# Altium schematic sheet ife19_TS_TSAL-Discharge-TSMP.SchDoc
size A
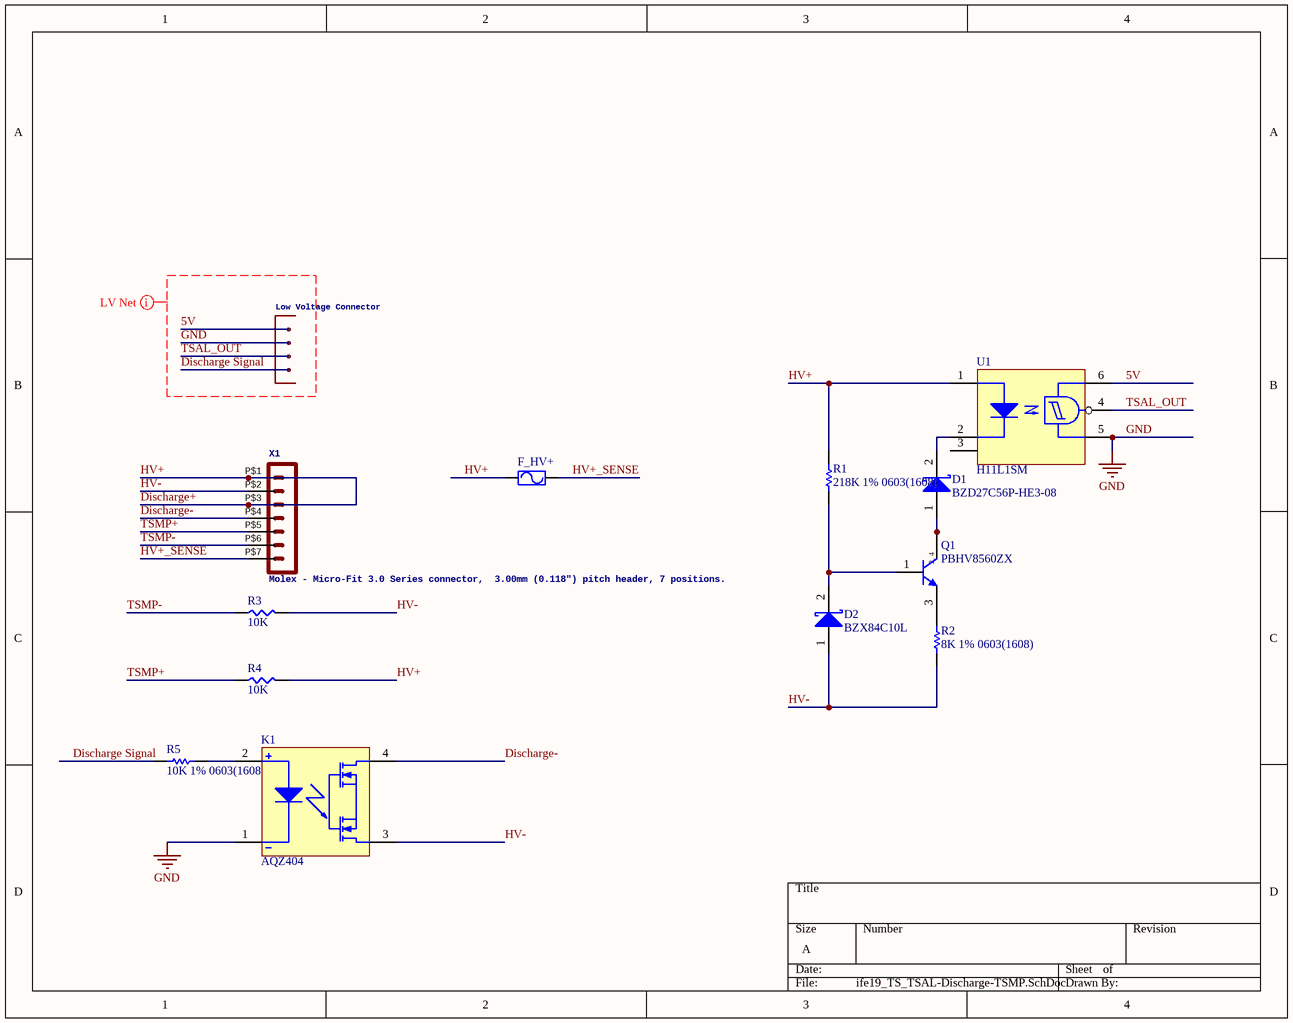
[diagram p0: ife19_TS_TSAL-Discharge-TSMP.SchDoc]

## Parts
D1  BZD27C56P-HE3-08  [VISH-DO-219AB_V]
D2  BZX84C10L  [VISH-DO-219AB_V]
F_HV+  FUSE_885  [FUSE_885]  (value not drawn)
K1  AQZ404  [PNSC-SIL4_V]
Low_Voltage_Connector  (no value)  [505575-04]
Q1  PBHV8560ZX  [NXP-SOT223_L]
R1  218K 1% 0603(1608)  [RESC0603(1608)_L]
R2  8K 1% 0603(1608)  [RESC0603(1608)_L]
R3  10K  [Ohmite 45]
R4  10K  [Ohmite 45]
R5  10K 1% 0603(1608)  [RESC0603(1608)_L]
U1  H11L1SM  [FAIR-SMT-6_V]
X1  Molex - Micro-Fit 3.0 Series connector,  3.00mm (0.118") pitch header, 7 positions.  [43650-0724]

## Nets
GND: K1.1(-) Low_Voltage_Connector.2 U1.5(GND)
5V: Low_Voltage_Connector.1 U1.6(VCC)
Discharge Signal: Low_Voltage_Connector.4 R5.2
Discharge+: F_HV+.2 R1.2 R4.2 U1.1(ANODE) X1.P$1 X1.P$3  [also labelled HV+]
Discharge-: K1.4 X1.P$4
HV+_SENSE: F_HV+.1 X1.P$7
HV-: D2.1(A) K1.3 R2.1 R3.2 X1.P$2
TSAL_OUT: Low_Voltage_Connector.3 U1.4(VO)
TSMP+: R4.1 X1.P$5
TSMP-: R3.1 X1.P$6
NetD1_1: D1.1(A) Q1.2(C) Q1.4(C)
NetD1_2: D1.2(K) U1.2(CATHODE)
NetD2_2: D2.2(K) Q1.1(B) R1.1
NetK1_2: K1.2(+) R5.1
NetQ1_3: Q1.3(E) R2.2

Not connected (* = marked no-connect by the designer): U1 3(NC)

## Layout directives
net class Low Voltage: 5V, Discharge Signal, GND, TSAL_OUT

## Notes on the sheet
- (in symbol CMP-2000-05940-1) 2, 4

## Library data of the parts
D1 D2 = CMP-1711-00001-1: Schottky Rectifier, 30 V, 1.1 A, 2-Pin DO-219AB (SMF), RoHS, Tape and Reel; PartNumber: SL03-GS08CT; Manufacturer: Vishay Semiconductor; ComponentLink1URL: http://www.vishay.com/; DatasheetVersion: Rev. 2.0; Mounting Technology: Surface Mount; ComponentLink2URL: http://www.vishay.com/docs/85687/sl02.pdf; PackageReference: DO-219AB; ComponentLink1Description: Manufacturer URL; PackageDescription: 2-Pin Small Outline Diode, Flat Lead, Body 1.90 x 2.9 mm; ComponentLink2Description: Datasheet
K1 = CMP-1346-00024-1: PhotoMOS Power 1 Form B, 400 V Load Voltage, 0.5 A Continuous Load Current, -40 to 85 degC, 4-Pin SIL, Carton, RoHS; Manufacturer: Panasonic; Continuous Load Current: 0.5 A; Load Voltage: 400 V; On Resistance (Typ): 2.8 Ohm; Pb-Free: True; Packing: Carton; PartNumber: AQZ404; Series: PhotoMOS Power 1 Form B; RoHS: True; ComponentLink3Description: Package Specification; DatasheetVersion: 201404-T; ComponentLink1URL: http://www3.panasonic.biz/ac/ae/index.jsp; ComponentLink2URL: http://www3.panasonic.biz/ac/e_download/control/relay/photomos/catalog/semi_eng_pwr1b_aqz40.pdf?f_cd=301392; PackageVersion: ASCTB67E, 04/2014; ComponentLink1Description: Manufacturer URL; ComponentLink3URL: http://www3.panasonic.biz/ac/e_download/control/relay/photomos/catalog/semi_eng_dimensions.pdf?f_cd=401560; ComponentLink2Description: Datasheet; Mounting Technology: Through Hole; PackageReference: SIL4; PackageDescription: 4-Pin Through Hole Terminal Package, Body 21 x 3.5 mm
Low_Voltage_Connector = 505575-04: GateName_1: G$1; SymbolName_1: 4POS; LibraryName: MOLEX Micro-Lock; DeviceSetName: 505575-04; Package: 505575-04
Q1 = CMP-2000-05940-1: NPN Medium Power Transistor, 60 V, 1 A, -55 to 150 degC, 4-Pin SOT223, RoHS, Tape and Reel; Manufacturer: NXP Semiconductors; Vce Saturation (Max) @ Ib, Ic: 500mV@50mA,500mA; PCN Packaging: LighterReels02/Jan/2014; Online Catalog: NPNTransistors; Frequency - Transition: 180MHz; Voltage - Collector Emitter Breakdown (Max): 60V; Power - Max: 1.35W; Current - Collector Cutoff (Max): 100nA(ICBO); Current - Collector (Ic) (Max): 1A; Other Names: 568-8013-6; PCN Design/Specification: ResinHardener02/Jul/2013; Package Version: 06-03-16, 03/2006; DC Current Gain (hFE) (Min) @ Ic, Vce: 100@150mA,2V; Featured Product: NXP-I²CInterface; Manufacturer URL: http://www.nxp.com/; Packaging: Digi-Reel®; Mounting Technology: SurfaceMount; Package / Case: TO-261-4,TO-261AA; Standard Package: 1; Series: -; Datasheet URL: http://www.nxp.com/documents/data_sheet/BCP55_BCX55_BC55PA.pdf?fasp=1&WT_TYPE=Data%20Sheets&WT_VENDOR=FREESCALE&WT_FILE_FORMAT=pdf&WT_ASSET=Documentation&fileExt=.pdf; Package URL: http://www.nxp.com/documents/outline_drawing/SOT223.pdf; Package Description: 4-Pin Small Outline Transistor Package, Body 6.5 x 3.5 mm, Pitch 2.3 mm; Category: DiscreteSemiconductorProducts; Family: Transistors(BJT)-Single; Transistor Type: NPN; Datasheet Version: Rev. 8, 10/2011; Package Reference: SOT223; Supplier Device Package: SC-73; Mounting Type: SurfaceMount
R1 R5 = CMP-1012-00779-1: 249K 0.1W 1% 0603 (1608 Metric)  SMD; Case-Metric: 1608; Case-EIA: 0603; Value: 249000.00 Ohm; Technology: SMT; Power: 0.1 W; Tolerance: 1 %
R2 = CMP-1012-00796-1: 348K 0.1W 1% 0603 (1608 Metric)  SMD; Value: 348000.00 Ohm; Case-Metric: 1608; Case-EIA: 0603; Tolerance: 1 %; Power: 0.1 W; Technology: SMT
R3 R4 = Ohmite 40 Series
U1 = CMP-2000-06383-1: Schmitt Trigger Output Optocoupler, 3 to 15 V, -40 to 85 degC, 6-Pin SMT, RoHS, Tube; Manufacturer: Fairchild Semiconductor; Input Type: DC; Forward Voltage: 1.5V; Forward Current: 30mA; Power Dissipation: 250mW; Isolation Voltage: 7500Vrms; Reverse Breakdown Voltage: 6V; Number of  Elements: 1; Output Type: OpenCollector; Propagation Delay Time: 4000ns; Output Current: 50mA; Package Reference: SMT-6; Operating Temperature Classification: Industrial; Datasheet Version: Rev. 1.0.7, 09/2014; Mounting: SurfaceMount; Operating Temp Range: -40Cto85C; Package Type: PDIPSMDWhite; Manufacturer URL: https://www.fairchildsemi.com/; Datasheet URL: http://www.mouser.com/ds/2/149/H11L1M-185291.pdf; Mounting Technology: SurfaceMount; Pin Count: 6; Package Description: 6-Pin Surface Mount Device, Body 8.51 x 6.35 mm, Pitch 2.54 mm
X1 = POS7_MF43650-0724: GateName_1: G$1; SymbolName_1: HEADER_POS7; DeviceSetName: HEADER_POS7_?; DeviceName: 43650-0724; LibraryName: MOLEX Micro-Fit; Package: 43650-0724